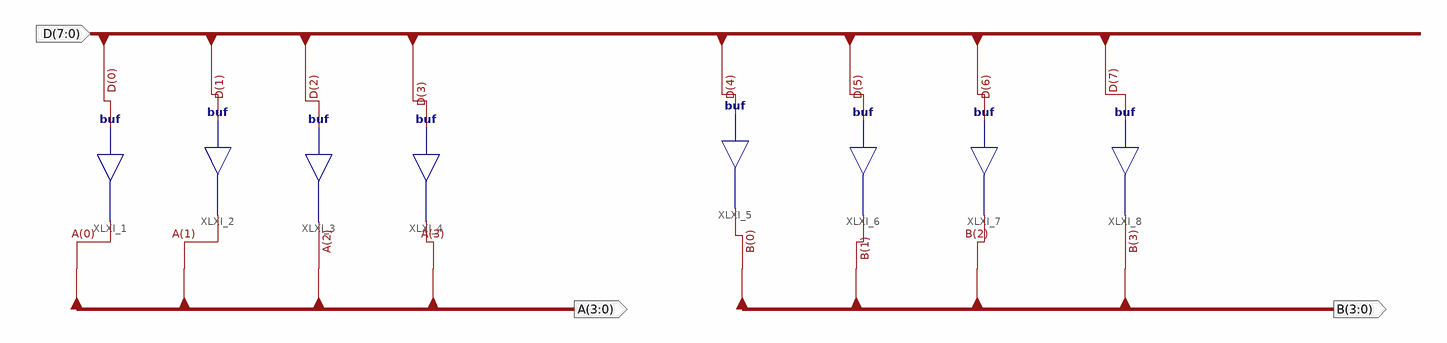
[diagram p0: schematic sheet 1]
// Xilinx ISE schematic eightTOtwoHEX.sch (spartan3e) as structural Verilog: 8 symbols, 3 ports
module eightTOtwoHEX (
  input  [7:0] D,
  output [3:0] A,
  output [3:0] B
);

  buf XLXI_1 (A[0], D[0]);
  buf XLXI_2 (A[1], D[1]);
  buf XLXI_3 (A[2], D[2]);
  buf XLXI_4 (A[3], D[3]);
  buf XLXI_5 (B[0], D[4]);
  buf XLXI_6 (B[1], D[5]);
  buf XLXI_7 (B[2], D[6]);
  buf XLXI_8 (B[3], D[7]);
endmodule
